# Altium schematic sheet 06. ETHERNET.SchDoc
size A4; DocumentNumber: 5; SheetNumber: 5; SheetTotal: 12
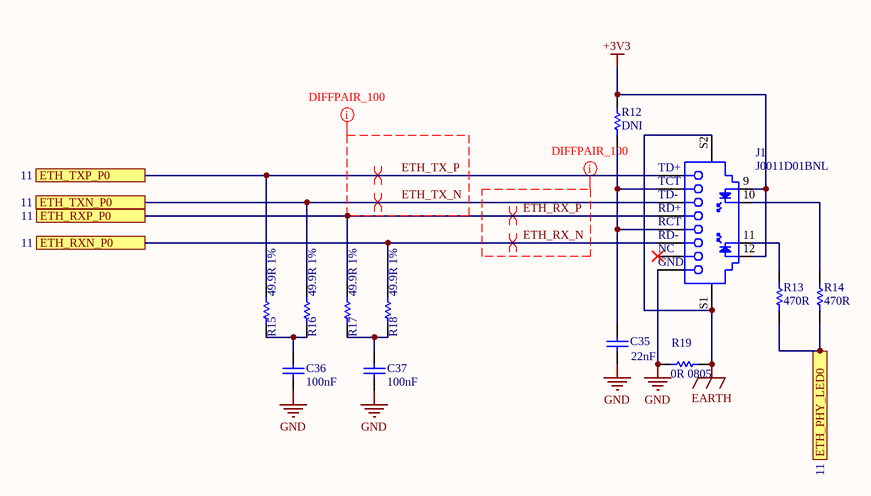
[diagram p0: 06. ETHERNET.SchDoc]

## Parts
C35  22nF  [CAPC1005X60X30LL05T10]
C36  100nF  [CAPC1005X60X30LL05T10]
C37  100nF  [CAPC1005X60X30LL05T10]
J1  J0011D01BNL  [J0011D01BNL 1PORT 100 BASE-TX]
R12  DNI  [RESC1005X40X25LL05T05]
R13  470R  [RESC1005X40X25LL05T05]
R14  470R  [RESC1005X40X25LL05T05]
R15  49.9R 1%  [RESC1005X40X25LL05T05]
R16  49.9R 1%  [RESC1005X40X25LL05T05]
R17  49.9R 1%  [RESC1005X40X25LL05T05]
R18  49.9R 1%  [RESC1005X40X25LL05T05]
R19  0R 0805  [RESC2013X50X30LL20T20]

## Ports
ETH_PHY_LED0 (see 11), ETH_RXN_P0 (see 11), ETH_RXP_P0 (see 11), ETH_TXN_P0 (see 11), ETH_TXP_P0 (see 11)

## Nets
+3V3: J1.9 J1.12 R12.2
EARTH: J1.S1 J1.S2 R19.2
GND: C35.1 C36.1 C37.1 J1.8(GND) R19.1
ETH_PHY_LED0: R13.1 R14.1 ; port ETH_PHY_LED0
ETH_RX_N: J1.6(RD-) R18.2 ; port ETH_RXN_P0
ETH_RX_P: J1.4(RD+) R17.2 ; port ETH_RXP_P0
ETH_TX_N: J1.3(TD-) R16.2 ; port ETH_TXN_P0
ETH_TX_P: J1.1(TD+) R15.2 ; port ETH_TXP_P0
NetC35_2: C35.2 J1.2(TCT) J1.5(RCT) R12.1
NetC36_2: C36.2 R15.1 R16.1
NetC37_2: C37.2 R17.1 R18.1
NetJ1_10: J1.10 R14.2
NetJ1_11: J1.11 R13.2

Not connected (* = marked no-connect by the designer): J1 7(NC)*

## Layout directives
differential pair: ETH_RX_N, ETH_RX_P, ETH_TX_N, ETH_TX_P
net class ETHERNET; rule Matched Net Lengths [Tolerance = 10mil]; rule Differential Pairs Routing [Pref Gap = 0.185mm    Min Gap  = 0.1mm    Max Gap  = 0.185mmPref Width = 0.1mm    Min Width  = 0.1mm    Max Width  = 0.1mm]: ETH_RX_N, ETH_RX_P, ETH_TX_N, ETH_TX_P

## Notes on the sheet
- Title
- Size:
- Date:
- A4
- Number:
- Time:
- Revision:
- Sheet
- of
- N.S.T
- Design by:
- Check by:
- https://github.com/tung080827

## Library data of the parts
C35 = CMP-2008-04654-1: Part Number: GRM155R71H223KA12D; Manufacturer: Murata
C36 C37 = CMP-2100-03641-1: Chip Capacitor, 0.1 uF, +/- 10%, 16 V, -55 to 125 degC, 0402 (1005 Metric), RoHS, Tape and Reel; Manufacturer: Murata; Material: Ceramic; Insulation Resistance: 10GR; Voltage: 16V; Dielectric: X7R; REACH SVHC: NoSVHC; Depth: 0.5mm; Case/Package: 0402; Datasheet URL: http://psearch.en.murata.com/capacitor/product/GRM155R71C104KA88%23.pdf; Lead Free: LeadFree; Dielectric Material: Ceramic; Manufacturer URL: http://www.murata.com/; Min Operating Temperature: -55degC; Length: 1mm; Case Code (Metric): 1005; Radiation Hardening: No; Package Reference: 0402; RoHSCompliant: true; Datasheet Version: 42675.0; Thickness: 0.022inch; Packaging: TapeandReel; Voltage Rating (DC): 16V; Tolerance: 10%; Max Operating Temperature: 125degC; Package Description: 2-Pin Surface Mount Device, Body 1 x 0.5 mm; Mount: SurfaceMount; Height: 0.5mm; Width: 0.5mm; Number of Pins: 2; Voltage Rating: 16V; Case Code (Imperial): 0402; Termination: SMD/SMT; Capacitance: 100nF; Package Quantity: 1
J1 = CMP-2000-06492-1: RJ45 Connector, Pitch 1.27 mm, 12 Position, Height 13.84 mm, Tail Length 3.3 mm, 0 to 70 degC, RoHS, Tray; Manufacturer: Pulse Electronics; Dynamic Catalog: PULSEJACK™J0andJ2Series; Shield Material: Brass; Shielding: Shielded; LED Color: Green-Yellow; Number of Ports: 1; Number of Cores per Jack: 4; Catalog Drawings: PULSEJACKRightAngle1x1; Other Names: 553-1483 / J0011D01BNL-ND; Tab Direction: Down; Package Description: RJ45 Connector, Pitch 1.27 mm, 12 Position, Height 13.84 mm, Tail Length 3.3 mm; Number of Rows: 1; Contact Finish Thickness: 15µin(0.38µm); Datasheet URL: http://productfinder.pulseeng.com/products/datasheets/J403.pdf; Connector Type: RJ45; Mounting Type: ThroughHole; Package Reference: J0-A; Orientation: 90°Angle(Right); Termination: Solder; Datasheet Version: Rev. K, 08/2012; Applications: 10/100Base-TX,AutoMDIX; Series: PULSEJACK™J0; Contact Finish: Gold; Height Above Board: 0.545"(13.84mm); Operating Temperature: 0°C~70°C; Packaging: Tray; Contact Material: PhosphorBronze; Standard Package: 30; Housing Material: Thermoplastic; Features: BoardGuide; Category: Connectors,Interconnects; Mounting Technology: ThroughHole; Manufacturer URL: http://www.pulseelectronics.com/; Family: ModularConnectors-JacksWithMagnetics
R12 = CMP-2002-03046-1: Part Number: CRCW040210R0FKEDHP; Manufacturer: Vishay Dale
R13 R14 = CMP-2000-03373-1: Part Number: CRCW0603470RFKEA; Manufacturer: Vishay Dale
R15-R18 = CMP-2002-00969-1: Precision Thick Film Chip Resistors; Manufacturer: Panasonic; Part Number: ERJ-2RKF49R9X
R19 = CMP-2001-04896-1: Manufacturer: Vishay Dale; Part Number: CRCW08050000Z0EA